# Altium schematic sheet ATMEGA16U2-MU.SchDoc
size A4; SheetNumber: 1; SheetTotal: 3
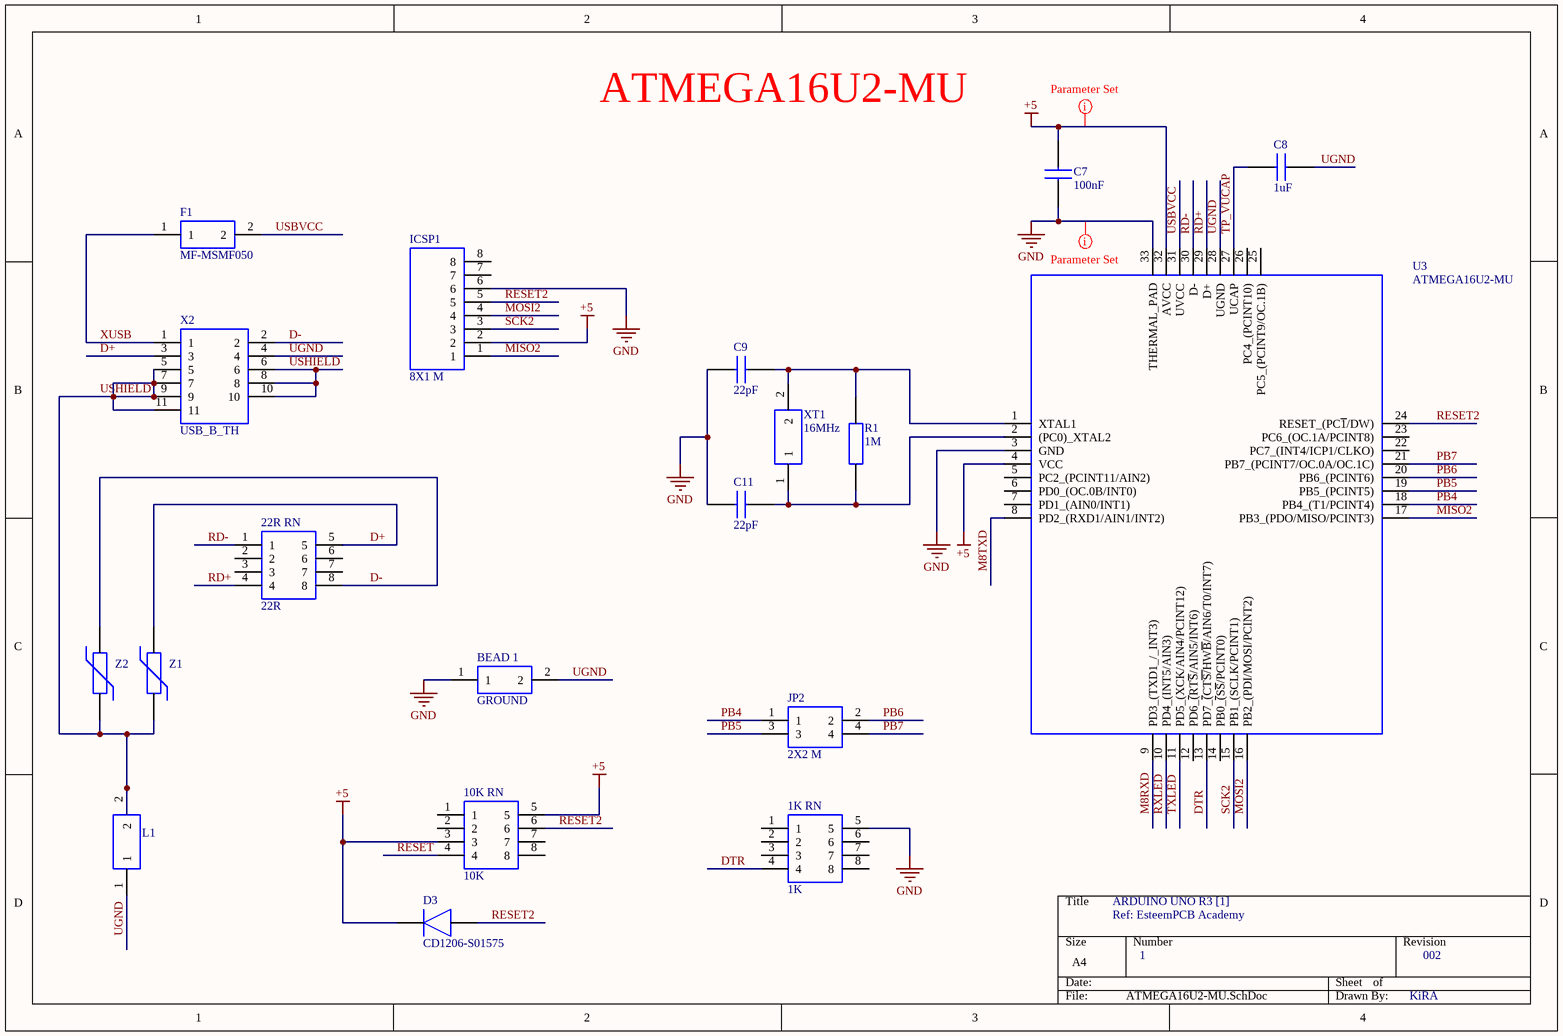
[diagram p0: ATMEGA16U2-MU.SchDoc]

## Parts
1K_RN  1K  [CAY10-XXXJ4]
10K_RN  10K  [CAY10-XXXJ4]
22R_RN  22R  [CAY10-XXXJ4]
BEAD_1  GROUND  [BEADC2012X105N]
C7  100nF  [CAPC2012X130N]
C8  1uF  [CAPC2012X145N]
C9  22pF  [CAPC2012X70N]
C11  22pF  [CAPC2012X70N]
D3  CD1206-S01575  [DIOC3016X65N]
F1  MF-MSMF050  [FUSC4632X75N]
ICSP1  8X1 M  [HDRV8W90P0X254_1X8_2032X249X560P]
JP2  2X2 M  [HDRV4W77P254_2X2_467X488X821P]
L1  BLM21BD601SH1D  [BEADC2012X105N]  (value not drawn)
R1  1M  [RESC1608X55N]
U3  ATMEGA16U2-MU  [QFN50P500X500X100-33N-D]
X2  USB_B_TH  [17340351]
XT1  16MHz  [MODEL-445]
Z1  CG0603MLC-05E  [VARC1608X55N]  (value not drawn)
Z2  CG0603MLC-05E  [VARC1608X55N]  (value not drawn)

## Nets
+5: 10K_RN.3 10K_RN.5 C7.2 D3.1(K) ICSP1.2 U3.4(VCC) U3.32(AVCC)
GND: 1K_RN.5 BEAD_1.1 C7.1 C9.1 C11.1 ICSP1.6 U3.3(GND) U3.33(THERMAL_PAD)
D+: 22R_RN.5 X2.3 Z1.2
D-: 22R_RN.8 X2.2 Z2.2
DTR: 1K_RN.4 U3.13(PD7_~{(}CT~{S/}HW~{B}/AIN6/T0/INT7))
M8RXD: U3.9(PD3_(TXD1_/_INT3))
M8TXD: U3.8(PD2_(RXD1/AIN1/INT2))
MISO2: ICSP1.1 U3.17(PB3_(PDO/MISO/PCINT3))
MOSI2: ICSP1.4 U3.16(PB2_(PDI/MOSI/PCINT2))
PB4: JP2.1 U3.18(PB4_(T1/PCINT4))
PB5: JP2.3 U3.19(PB5_(PCINT5))
PB6: JP2.2 U3.20(PB6_(PCINT6))
PB7: JP2.4 U3.21(PB7_(PCINT7/OC.0A/OC.1C))
RD+: 22R_RN.4 U3.29(D+)
RD-: 22R_RN.1 U3.30(D-)
RESET: 10K_RN.4
RESET2: 10K_RN.6 D3.2(A) ICSP1.5 U3.24(RESET_(PC~{1}/DW))
RXLED: U3.10(PD4_(INT5/AIN3))
SCK2: ICSP1.3 U3.15(PB1_(SCLK/PCINT1))
TP_VUCAP: C8.2 U3.27(UCAP)
TXLED: U3.11(PD5_(XCK/AIN4/PCINT12))
UGND: BEAD_1.2 C8.1 L1.1 U3.28(UGND) X2.4
USBVCC: F1.2 U3.31(UVCC)
USHIELD: L1.2 X2.5 X2.6 X2.7 X2.8 X2.9 X2.10 X2.11 Z1.1 Z2.1
XUSB: F1.1 X2.1
NetC9_2: C9.2 R1.2 U3.1(XTAL1) XT1.2
NetC11_2: C11.2 R1.1 U3.2((PC0)_XTAL2) XT1.1

Not connected (* = marked no-connect by the designer): 1K_RN 1 2 3 6 7 8; 10K_RN 1 2 7 8; 22R_RN 2 3 6 7; ICSP1 7 8; U3 5(PC2_(PCINT11/AIN2)) 6(PD0_(OC.0B/INT0)) 7(PD1_(AIN0/INT1)) 12(PD6_~{(}RT~{S}/AIN5/INT6)) 14(PB0_~{(}S~{S}/PCINT0)) 22(PC7_(INT4/ICP1/CLKO)) 23(PC6_(OC.1A/PCINT8)) 25(PC5_(PCINT9/OC.1B)) 26(PC4_(PCINT10))

## Layout directives
rule Width Constraint [Pref Width = 0.3mm    Min Width = 0.3mm    Max Width = 0.3mm]: +5, GND

## Notes on the sheet
- ATMEGA16U2-MU
- ARDUINO UNO R3 [1]
- Ref: EsteemPCB Academy
- 1
- 002
- KiRA

## Library data of the parts
1K_RN 10K_RN 22R_RN = CAY10-220J4LF: CAY10 convex chip resistor array,22R Bourns CAY10 Series 22 5% Isolated SMT Resistor Array, 4 Resistors, 0.125W total 0804 package Convex; Allied_Number: 70276318; Manufacturer_Name: Bourns; Manufacturer_Part_Number: CAY10-220J4LF; RS Part Number: 1674746; RS Price/Stock: http://uk.rs-online.com/web/p/products/1674746; Allied Price/Stock: https://www.alliedelec.com/bourns-cay10-220j4lf/70276318/; Mouser Part Number: 652-CAY10-220J4LF; Mouser Price/Stock: https://www.mouser.com/Search/Refine.aspx?Keyword=652-CAY10-220J4LF; Datasheet Link: http://docs-emea.rs-online.com/webdocs/064e/0900766b8064e463.pdf
BEAD_1 L1 = BLM21BD601SH1D: Chip Ferrite Bead 600R 0805 300mA 1LN; Manufacturer_Name: Murata Electronics; Geometry.Height: 1.05mm; Manufacturer_Part_Number: BLM21BD601SH1D; RS Part Number: 1048541P; RS Price/Stock: http://uk.rs-online.com/web/p/products/1048541P; Mouser Part Number: 81-BLM21BD601SH1D; Mouser Price/Stock: https://www.mouser.com/Search/Refine.aspx?Keyword=81-BLM21BD601SH1D; Datasheet Link: https://componentsearchengine.com/Datasheets/2/BLM21BD601SH1D.pdf
C7 = 0805Y0500104KXT: Syfer Technology 0805 Flexicap 100nF Ceramic Multilayer Capacitor, 50 V, +125C, X7R Dielectric, 10% SMD; Geometry.Height: 1.3mm; Manufacturer_Name: Syfer; Manufacturer_Part_Number: 0805Y0500104KXT; RS Part Number: 7738389P; RS Price/Stock: http://uk.rs-online.com/web/p/products/7738389P; Mouser Part Number: 7738389P; Mouser Price/Stock: http://uk.rs-online.com/web/p/products/7738389P; Datasheet Link: http://docs-emea.rs-online.com/webdocs/119d/0900766b8119d7bc.pdf
C8 = C2012C0G2A103J125AA: Multilayer Ceramic Capacitors MLCC - SMD/SMT 0805 C0G 100volts 0.01uF 5% 1.25mm; Manufacturer_Name: TDK; Geometry.Height: 1.45mm; Manufacturer_Part_Number: C2012C0G2A103J125AA; RS Part Number: *; RS Price/Stock: *; Mouser Part Number: 810-C2012C0G2A103JAA; Mouser Price/Stock: https://www.mouser.com/Search/Refine.aspx?Keyword=810-C2012C0G2A103JAA; Datasheet Link: https://product.tdk.com/info/en/catalog/datasheets/mlcc_commercial_midvoltage_en.pdf
C9 C11 = GRM2165C1H220JZ01D: MURATA - GRM2165C1H220JZ01D - CAP, MLCC, C0G/NP0, 22PF, 50V, 0805; Manufacturer_Name: Murata Electronics; Geometry.Height: 0.7mm; Manufacturer_Part_Number: GRM2165C1H220JZ01D; RS Part Number: 7236243; RS Price/Stock: http://uk.rs-online.com/web/p/products/7236243; Mouser Part Number: 81-GRM2165C1H220JZ; Mouser Price/Stock: https://www.mouser.com/Search/Refine.aspx?Keyword=81-GRM2165C1H220JZ; Datasheet Link: http://www.murata.com/~/media/webrenewal/support/library/catalog/products/capacitor/mlcc/c02e.pdf
D3 = CD1206-S01575: Diode Switching 100V 0.15A 4ns SMD1206 Bourns CD1206-S01575 Switching Diode, 150mA, 100V, 4ns, 2-Pin 1206; Allied_Number: 70154675; Geometry.Height: 0.65mm; Manufacturer_Name: Bourns; Manufacturer_Part_Number: CD1206-S01575; RS Part Number: 1775431; RS Price/Stock: http://uk.rs-online.com/web/p/products/1775431; Allied Price/Stock: http://www.alliedelec.com/bourns-cd1206-s01575/70154675/; Mouser Part Number: 652-CD1206-S01575; Mouser Price/Stock: https://www.mouser.com/Search/Refine.aspx?Keyword=652-CD1206-S01575; Datasheet Link: http://docs-emea.rs-online.com/webdocs/1189/0900766b811897a9.pdf
F1 = 1812L050_30PR: Littelfuse 0.5A Resettable Surface Mount Fuse, 30V dc; Manufacturer_Part_Number: 1812L050/30PR; Geometry.Height: 0.75mm; Manufacturer_Name: LITTELFUSE; RS Part Number: 8951631P; RS Price/Stock: http://uk.rs-online.com/web/p/products/8951631P; Mouser Part Number: 576-1812L050/30PR; Mouser Price/Stock: https://www.mouser.com/Search/Refine.aspx?Keyword=576-1812L050%2F30PR; Datasheet Link: https://www.arrow.com/en/products/1812l05030pr/littelfuse
ICSP1 = 90120-0768: 8 way single row straight header Molex C-GRID III Series, Series Number 90120, 2.54mm Pitch 8 Way 1 Row Straight Pin Header, Through Hole; Allied_Number: 70372836; Geometry.Height: 5.6mm; Manufacturer_Name: Molex; Manufacturer_Part_Number: 90120-0768; RS Part Number: 1671900; RS Price/Stock: http://uk.rs-online.com/web/p/products/1671900; Allied Price/Stock: https://www.alliedelec.com/molex-incorporated-90120-0768/70372836/; Mouser Part Number: 538-90120-0768; Mouser Price/Stock: https://www.mouser.com/Search/Refine.aspx?Keyword=538-90120-0768; Datasheet Link: http://www.molex.com/molex/products/datasheet.jsp?part=active/0901200768_PCB_HEADERS.xml
JP2 = 5-146256-2: AMP - TE CONNECTIVITY - 5-146256-2 - CONNECTOR, HEADER, 4 POSITION, 2ROWS, 2.54MM; Allied_Number: 70085239; Geometry.Height: 8.21mm; Manufacturer_Name: TE Connectivity; Manufacturer_Part_Number: 5-146256-2; RS Part Number: 7972955; RS Price/Stock: http://uk.rs-online.com/web/p/products/7972955; Allied Price/Stock: https://www.alliedelec.com/te-connectivity-5-146256-2/70085239/; Mouser Part Number: 571-5-146256-2; Mouser Price/Stock: https://www.mouser.com/Search/Refine.aspx?Keyword=571-5-146256-2; Datasheet Link: http://www.mouser.com/ds/2/418/NG_CD_146256_H-649289.pdf
R1 = CPF0603B1M0E1: TE CONNECTIVITY - CPF0603B1M0E1 - RES, THIN FILM, 1M, 0.1%, 0.063W, 0603; Geometry.Height: 0.55mm; Manufacturer_Name: TE Connectivity; Manufacturer_Part_Number: CPF0603B1M0E1; RS Part Number: *; RS Price/Stock: *; Mouser Part Number: 279-CPF0603B1M0E1; Mouser Price/Stock: https://www.mouser.com/Search/Refine.aspx?Keyword=279-CPF0603B1M0E1; Datasheet Link: http://www.farnell.com/datasheets/1786775.pdf
U3 = ATMEGA16U2-MU: 8-bit Microcontrollers - MCU AVR USB 8K FLASH AVR USB 16K FLASH; Manufacturer_Name: Microchip; Geometry.Height: 1mm; Manufacturer_Part_Number: ATMEGA16U2-MU; RS Part Number: 1717746; RS Price/Stock: http://uk.rs-online.com/web/p/products/1717746; Mouser Part Number: 556-ATMEGA16U2-MU; Mouser Price/Stock: https://www.mouser.com/Search/Refine.aspx?Keyword=556-ATMEGA16U2-MU; Datasheet Link: http://ww1.microchip.com/downloads/en/DeviceDoc/doc7799.pdf
X2 = 1734035-1: AMP - TE CONNECTIVITY - 1734035-1. - MINI USB, 2.0 TYPE B, RECEPTACLE, SMT; Allied_Number: 70086812; Geometry.Height: 4mm; Manufacturer_Name: TE Connectivity; Manufacturer_Part_Number: 1734035-1; RS Part Number: *; RS Price/Stock: *; Allied Price/Stock: https://www.alliedelec.com/te-connectivity-1734035-1/70086812/; Mouser Part Number: 571-1734035-1; Mouser Price/Stock: https://www.mouser.com/Search/Refine.aspx?Keyword=571-1734035-1; Datasheet Link: http://www.te.com/commerce/DocumentDelivery/DDEController?Action=srchrtrv&DocNm=1734035&DocType=Customer+Drawing&DocLang=English
XT1 = 445I35D16M00000: Crystals 16MHz +/-30ppm 18pF -40C +85C; Manufacturer_Name: CTS; Manufacturer_Part_Number: 445I35D16M00000; RS Part Number: *; RS Price/Stock: *; Mouser Part Number: 774-445I35D16M00000; Mouser Price/Stock: https://www.mouser.com/Search/Refine.aspx?Keyword=774-445I35D16M00000; Datasheet Link: http://www.mouser.com/ds/2/96/008-0360-0-786290.pdf
Z1 Z2 = CG0603MLC-05E: Varistor, ESD Protector, 5VDC,20V,0603 Bourns MLC Series Power Varistor 0.5pF 20V 0603 Case; Allied_Number: 70153503; Geometry.Height: 0.55mm; Manufacturer_Name: Bourns; Manufacturer_Part_Number: CG0603MLC-05E; RS Part Number: 8518256; RS Price/Stock: http://uk.rs-online.com/web/p/products/8518256; Allied Price/Stock: https://www.alliedelec.com/bourns-cg0603mlc-05e/70153503/; Mouser Part Number: 652-CG0603MLC-05E; Mouser Price/Stock: https://www.mouser.com/Search/Refine.aspx?Keyword=652-CG0603MLC-05E; Datasheet Link: http://www.farnell.com/datasheets/1785244.pdf